# Altium schematic sheet power.SchDoc
size Tabloid; SheetNumber: 2; SheetTotal: 4; Page: Power
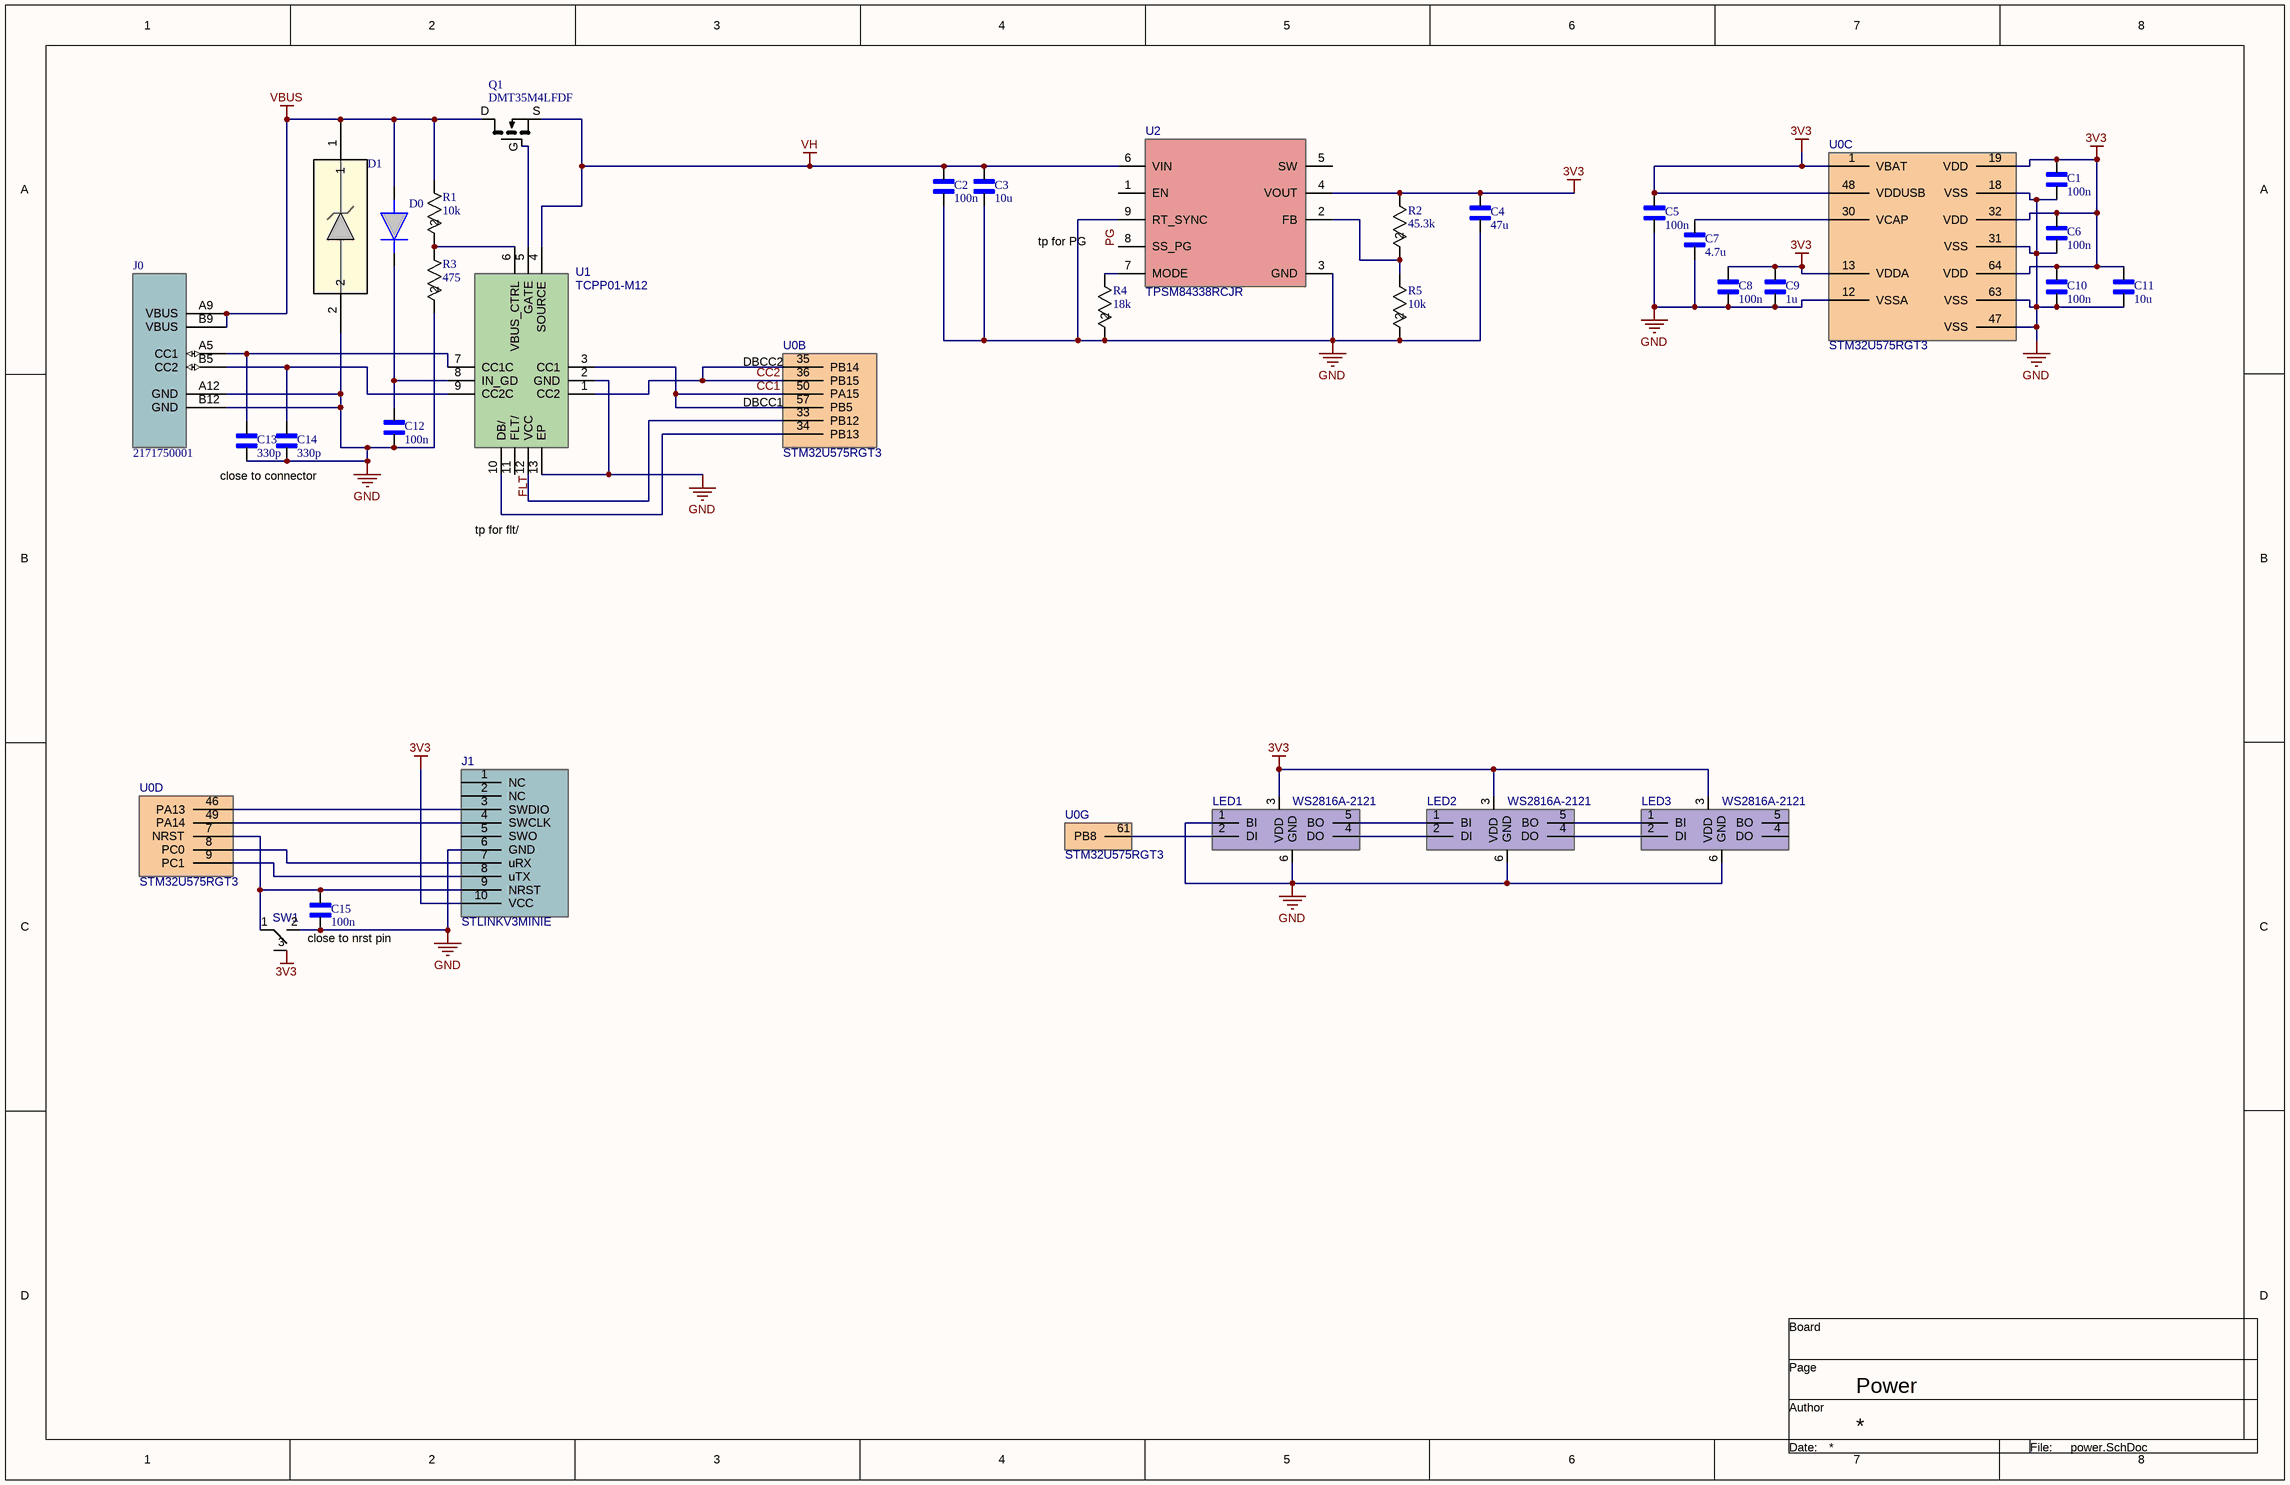
[diagram p0: power.SchDoc]

## Parts
(Parts that share a designator on the sheet are numbered #1, #2 ... from top to bottom, then left to right.)
C1  100n  [CAPC1005X55N]
C2  100n  [CAPC1005X55N]
C3  10u  [CAPC3225X270N]
C4  47u  [CAPC2012X145N]
C5  100n  [CAPC1005X55N]
C6  100n  [CAPC1005X55N]
C7  4.7u  [CAPC1005X55N]
C8  100n  [CAPC1005X55N]
C9  1u  [CAPC1005X55N]
C10  100n  [CAPC1005X55N]
C11  10u  [CAPC1005X55N]
C12  100n  [CAPC1005X55N]
C13  330p  [CAPC1005X55N]
C14  330p  [CAPC1005X55N]
C15  100n  [CAPC1005X55N]
D0  BAT54KFILM  [SODFL1608X70N]  (value not drawn)
D1  ESDA25P35-1U1M  [QFN1610_STM]  (value not drawn)
J0  2171750001  [2171750001_MOL]
J1  STLINKV3MINIE  [009159010061911]
LED1  WS2816A-2121  [ws2816a-2121]
LED2  WS2816A-2121  [ws2816a-2121]
LED3  WS2816A-2121  [ws2816a-2121]
Q1  DMT35M4LFDF  [U-DFN2020-6 (Type F)]
R1  10k  [RC0603N_YAG]
R2  45.3k  [RC0603N_YAG]
R3  475  [RC0603N_YAG]
R4  18k  [RC0603N_YAG]
R5  10k  [RC0603N_YAG]
SW1  B3U-3100P-B  [B3U3000PB]  (value not drawn)
U0#1  STM32U575RGT3  [QFP50P1200X1200X160-64N]  (parts B,C,D of 5)
U0#2  STM32U575RGT3  [QFP50P1200X1200X160-64N]  (part G of 7)
U1  TCPP01-M12  [QFN50P300X300X100-13N-D]
U2  TPSM84338RCJR  [RCJ0009A-MFG]

## Nets
3V3: C1.2 C4.2 C5.2 C6.2 C8.2 C9.2 C10.2 C11.2 J1.10(VCC) LED1.3(VDD) LED2.3(VDD) LED3.3(VDD) R2.1 SW1.3 U0#1.1(VBAT) U0#1.13(VDDA) U0#1.19(VDD) U0#1.32(VDD) U0#1.48(VDDUSB) U0#1.64(VDD) U2.4(VOUT)
GND: C1.1 C2.1 C3.1 C4.1 C5.1 C6.1 C7.1 C8.1 C9.1 C10.1 C11.1 C12.1 C13.1 C14.1 C15.1 D1.2 J0.A12(GND) J0.B12(GND) J1.6(GND) LED1.1(BI) LED1.6(GND) LED2.6(GND) LED3.6(GND) R3.2 R4.2 R5.2 SW1.2(N.O.) U0#1.12(VSSA) U0#1.18(VSS) U0#1.31(VSS) U0#1.47(VSS) U0#1.63(VSS) U1.2(GND) U1.13(EP) U2.3(GND) U2.9(RT_SYNC)
VBUS: D0.2(A) D1.1 J0.A9(VBUS) J0.B9(VBUS) Q1.D R1.1
VH: C2.2 C3.2 Q1.S U1.4(SOURCE) U2.6(VIN)
CC1: U0#1.50(PA15) U0#1.57(PB5) U1.3(CC1)
CC2: U0#1.35(PB14) U0#1.36(PB15) U1.1(CC2)
FLT: U1.11(FLT/)
PG: U2.8(SS_PG)
NetC7_2: C7.2 U0#1.30(VCAP)
NetC12_2: C12.2 D0.1(K) U1.8(IN_GD)
NetC13_2: C13.2 J0.A5(CC1) U1.7(CC1C)
NetC14_2: C14.2 J0.B5(CC2) U1.9(CC2C)
NetC15_2: C15.2 J1.9(NRST) SW1.1(COM) U0#1.7(NRST)
NetJ1_3: J1.3(SWDIO) U0#1.46(PA13)
NetJ1_4: J1.4(SWCLK) U0#1.49(PA14)
NetJ1_7: J1.7(uRX) U0#1.8(PC0)
NetJ1_8: J1.8(uTX) U0#1.9(PC1)
NetLED1_2: LED1.2(DI) U0#2.61(PB8)
NetLED1_4: LED1.4(DO) LED2.2(DI)
NetLED1_5: LED1.5(BO) LED2.1(BI)
NetLED2_4: LED2.4(DO) LED3.2(DI)
NetLED2_5: LED2.5(BO) LED3.1(BI)
NetQ1_G: Q1.G U1.5(GATE)
NetR1_2: R1.2 R3.1 U1.6(VBUS_CTRL)
NetR2_2: R2.2 R5.1 U2.2(FB)
NetR4_1: R4.1 U2.7(MODE)
NetU0#1_33: U0#1.33(PB12) U1.12(VCC)
NetU0#1_34: U0#1.34(PB13) U1.10(DB/)

Not connected (* = marked no-connect by the designer): J1 1(NC) 2(NC) 5(SWO); LED3 4(DO) 5(BO); U2 1(EN) 5(SW)

## Notes on the sheet
- tp for PG
- (near U0#1) DBCC2
- (near U0#1) DBCC1
- close to connector
- tp for flt/
- close to nrst pin
- Board
- Page
- Author
- Date:
- File:

## Library data of the parts
C1 C2 C5 C6 C8 C10 C12 C15 = UMK105B7104KVHF: CAP CER 0.1UF 50V X7R 0402; MF: {'manufacturer': u'Taiyo Yuden'}; Package: None; Price: None; Value: *; MP: UMK105B7104KVHF; Availability: Unavailable; Manufacturer_Part_Number: UMK105B7104KVHF
C3 = MSASU32MSB5106KPNA01: CAP CER 10UF 50V X5R 1210; MF: {'manufacturer': u'Taiyo Yuden'}; Package: None; Price: None; Value: *; MP: MSASU32MSB5106KPNA01; Availability: Unavailable; Manufacturer_Part_Number: MSASU32MSB5106KPNA01
C4 = MSASL21GBB5476MTNA01: CAP CER 47UF 10V X5R 0805; MF: {'manufacturer': u'Taiyo Yuden'}; Package: None; Price: None; Value: *; MP: MSASL21GBB5476MTNA01; Availability: Unavailable; Manufacturer_Part_Number: MSASL21GBB5476MTNA01
C7 = GRM155R60J475M: CAP CER 4.7UF 6.3V X5R 0402; MF: {'manufacturer': u'Taiyo Yuden'}; Package: None; Price: None; Value: *; MP: GRM155R60J475M; Availability: Unavailable; Manufacturer_Part_Number: GRM155R60J475M
C9 = GRM155R60J105K: CAP CER 1UF 6.3V X5R 0402; MF: {'manufacturer': u'Taiyo Yuden'}; Package: None; Price: None; Value: *; MP: GRM155R60J105K; Availability: Unavailable; Manufacturer_Part_Number: GRM155R60J105K
C11 = GRM155R60J106M: CAP CER 10UF 6.3V X5R 0402; MF: {'manufacturer': u'Taiyo Yuden'}; Package: None; Price: None; Value: *; MP: GRM155R60J106M; Availability: Unavailable; Manufacturer_Part_Number: GRM155R60J106M
C13 C14 = MCASU105SCG331JFNA01: CAP CER 330PF 50V C0G 0402; MF: {'manufacturer': u'Taiyo Yuden'}; Package: None; Price: None; Value: *; MP: MCASU105SCG331JFNA01; Availability: Unavailable; Manufacturer_Part_Number: MCASU105SCG331JFNA01
D0 = BAT54KFILM: BAT54KFILM, Schottky Diode,  0.3A max, 40V 5ns, 2-Pin, SOD-523; Manufacturer_Name: STMicroelectronics; Geometry.Height: 0.7mm; Manufacturer_Part_Number: BAT54KFILM; Mouser Part Number: 511-BAT54KFILM; Mouser Price/Stock: https://www.mouser.co.uk/ProductDetail/STMicroelectronics/BAT54KFILM?qs=jZi1jxfVU95Y9ce6l3OT%252BA%3D%3D; Arrow Part Number: BAT54KFILM; Arrow Price/Stock: https://www.arrow.com/en/products/bat54kfilm/stmicroelectronics?region=europe; Datasheet Link: https://www.st.com/resource/en/datasheet/bat54.pdf
D1 = ESDA25P35-1U1M: 35 A - 8/20 us, 22 V TVS in QFN-2L; Manufacturer_Name: STMicroelectronics; Copyright: Copyright (C) 2026 Ultra Librarian. All rights reserved.; Manufacturer_Part_Number: ESDA25P35-1U1M; RefDes: RefDes; Type: Type
J0 = 2171750001: Universal Serial Bus (USB) Shielded I/O Receptacle, Type C, Right-Angle,  Surface Mount, Top Mount, 6 Circuits, Gold (Au) Plating; Manufacturer_Name: Molex Connector Corporation; Copyright: Copyright (C) 2025 Ultra Librarian. All rights reserved.; Manufacturer_Part_Number: 2171750001; RefDes: RefDes; Type: Type
J1 = 009159010061911: KYOCERA-AVX 009159010061911
R1 R5 = RT0603BRD0710KL: 10K OHM 0.1% 1/10W 0603; Manufacturer_Name: Yageo; Copyright: Copyright (C) 2026 Ultra Librarian. All rights reserved.; Manufacturer_Part_Number: RT0603BRD0710KL
R2 = RT0603BRD0745K3L: 45.3K OHM 0.1% 1/10W 0603; Manufacturer_Name: Yageo; Copyright: Copyright (C) 2026 Ultra Librarian. All rights reserved.; Manufacturer_Part_Number: RT0603BRD0745K3L
R3 = RT0603BRE07475RL: 475 OHM 0.1% 1/10W 0603; Manufacturer_Name: Yageo; Copyright: Copyright (C) 2026 Ultra Librarian. All rights reserved.; Manufacturer_Part_Number: RT0603BRE07475RL
R4 = RT0603BRD0718KL: 18K OHM 0.1% 1/10W 0603; Manufacturer_Name: Yageo; Copyright: Copyright (C) 2026 Ultra Librarian. All rights reserved.; Manufacturer_Part_Number: RT0603BRD0718KL
SW1 = B3U-3100P-B: OMRON - B3U-3100P-B - TACTILE SWITCH, SIDE ACTUATED, SMD; Manufacturer_Name: OMRON Electronics; Geometry.Height: 1.35mm; Manufacturer_Part_Number: B3U-3100P-B; Mouser Part Number: 653-B3U-3000P-B; Mouser Price/Stock: https://www.mouser.co.uk/ProductDetail/Omron-Electronics/B3U-3000P-B?qs=AO7BQMcsEu4JAdtnbsGArA%3D%3D; Arrow Part Number: B3U-3000P-B; Arrow Price/Stock: https://www.arrow.com/en/products/b3u-3000p-b/omron?utm_currency=USD&region=nac; Datasheet Link: https://componentsearchengine.com/Datasheets/2/B3U-3000P-B.pdf
U0#1 U0#2 = STM32U575RGT3: Ultra-low-power Arm Cortex-M33 32-bit MCU+TrustZone+FPU, 240 DMIPS, up to 2 MB Flash memory, 786 KB SRAM; Manufacturer_Name: STMicroelectronics; Geometry.Height: 1.6mm; Manufacturer_Part_Number: STM32U575RGT3; Mouser Part Number: *; Mouser Price/Stock: *; Arrow Part Number: *; Arrow Price/Stock: *; Datasheet Link: https://www.st.com/resource/en/datasheet/stm32u575ag.pdf
U1 = TCPP01-M12: USB Type-C and power delivery protection for sink application; Manufacturer_Name: STMicroelectronics; Geometry.Height: 1mm; Manufacturer_Part_Number: TCPP01-M12; Mouser Part Number: 511-TCPP01-M12; Mouser Price/Stock: https://www.mouser.co.uk/ProductDetail/STMicroelectronics/TCPP01-M12?qs=%252B6g0mu59x7KCafIwapwG2A%3D%3D; Arrow Part Number: TCPP01-M12; Arrow Price/Stock: https://www.arrow.com/en/products/tcpp01-m12/stmicroelectronics.html?utm_currency=USD&region=europe; Datasheet Link: https://www.st.com/resource/en/datasheet/tcpp01-m12.pdf
U2 = TPSM84338RCJR: 3.8-V to 28-V Input, 3A, 200kHz-2.2MHz synchronous step-down power module 9-QFN-FCMOD -40 to 125; Manufacturer_Name: Texas Instruments; TYPE: TYPE; RefDes: RefDes; Copyright: Copyright (C) 2025 Ultra Librarian. All rights reserved.; Manufacturer_Part_Number: TPSM84338RCJR
LED1-LED3 = WS2816A-2121: Manufacturer_Part_Number: WS2816A-2121
Q1 = DMT35M4LFDF: Manufacturer_Part_Number: DMT35M4LFDF